# EAGLE design scout_mk1_b (EAGLE 7.1.0)
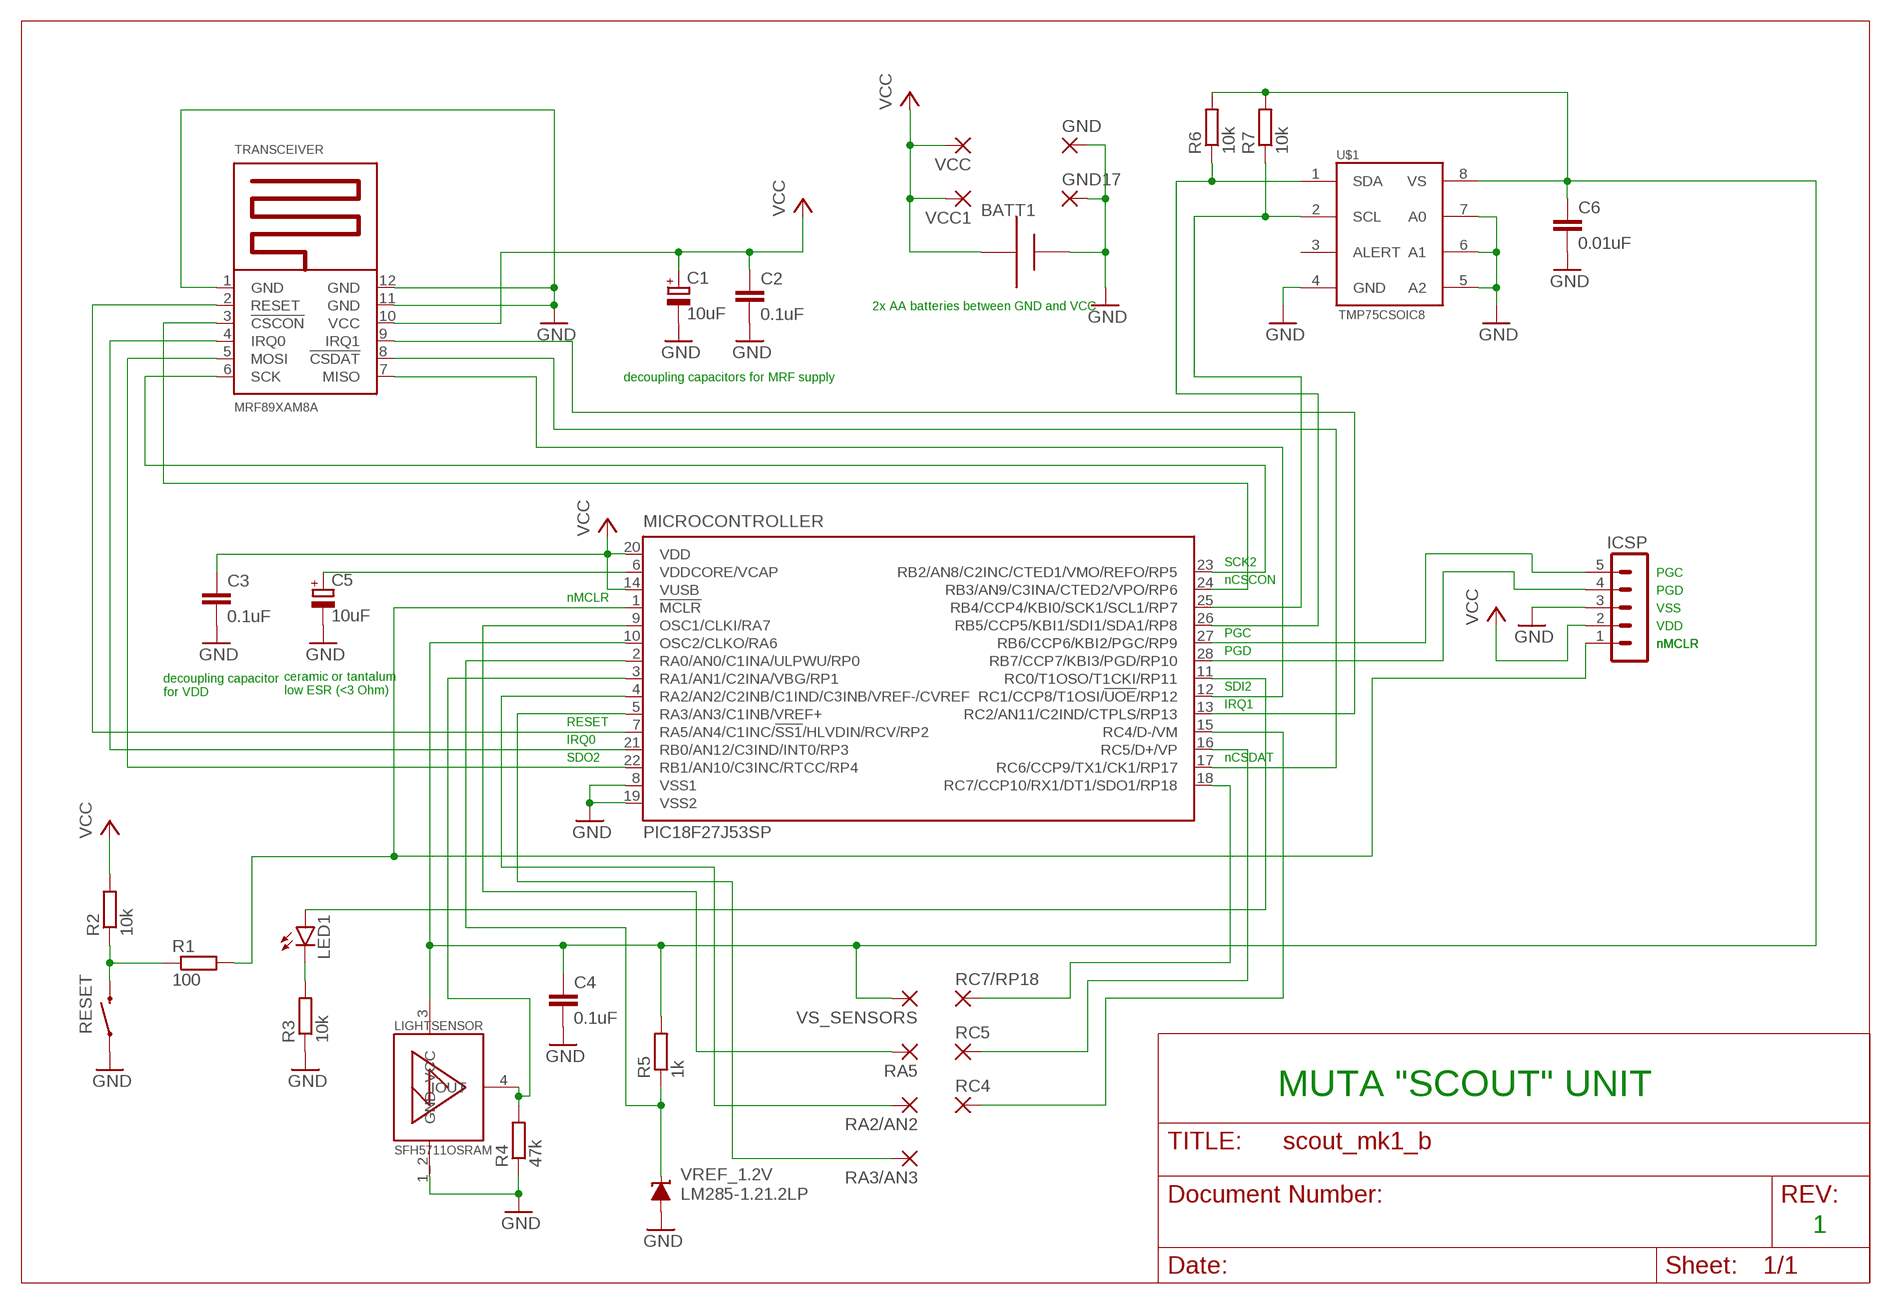
[diagram p0: schematic, sheet 1]

## Parts
BATT1  AAA  [2XAAA]
C1  10uF  CPOL-EUTT6D6  [TT5D6]
C2  0.1uF  C-EU050-025X075  [C050-025X075]
C3  0.1uF  C-EU050-025X075  [C050-025X075]
C4  0.1uF  C-EU050-025X075  [C050-025X075]
C5  10uF  CPOL-EUC/6032-28R  [C/6032-28R]
C6  0.01uF  C-EU050-025X075  [C050-025X075]
GND  3,81/1,1  [3,81/1,1]
GND17  3,81/1,1  [3,81/1,1]
ICSP  MA05-1  [MA05-1]
LED1  LED1206  [LED-1206]
LIGHTSENSOR  SFH5711OSRAM  [SFH5711]
MICROCONTROLLER  PIC18F27J53SP  [DIL28-3]
R1  100  R-EU_0207_10  [0207/10]
R2  10k  R-EU_0207_10  [0207/10]
R3  10k  R-EU_0207_2V  [0207/2V]
R4  47k  R-EU_0207_10  [0207/10]
R5  1k  R-EU_0207_10  [0207/10]
R6  10k  R-EU_0207_10  [0207/10]
R7  10k  R-EU_0207_10  [0207/10]
RA2/AN2  3,81/1,1  [3,81/1,1]
RA3/AN3  3,81/1,1  [3,81/1,1]
RA5  3,81/1,1  [3,81/1,1]
RC4  3,81/1,1  [3,81/1,1]
RC5  3,81/1,1  [3,81/1,1]
RC7/RP18  3,81/1,1  [3,81/1,1]
RESET  SWITCH-MOMENTARY-2PTH  [TACTILE-PTH]
TRANSCEIVER  MRF89XAM8A  [MRF89XAMXA]
U$1  TMP75CSOIC8  [SOIC8]
VCC  3,81/1,1  [3,81/1,1]
VCC1  3,81/1,1  [3,81/1,1]
VREF_1.2V  LM285-1.21.2LP  [LP_O-PBCY-W3]
VS_SENSORS  3,81/1,1  [3,81/1,1]

## Nets
GND: BATT1.P$1(+) C1.- C2.2 C3.2 C4.2 C5.- C6.2 GND17.1(P) GND.1(P) ICSP.3 LIGHTSENSOR.1_2(GND) MICROCONTROLLER.8(VSS1) MICROCONTROLLER.19(VSS2) R3.1 R4.1 RESET.1 TRANSCEIVER.1(GND) TRANSCEIVER.11(GND) TRANSCEIVER.12(GND) U$1.4(GND) U$1.5(A2) U$1.6(A1) U$1.7(A0) VREF_1.2V.3(A)
N$2: LIGHTSENSOR.4(IOUT) MICROCONTROLLER.3(RA1/AN1/C2INA/VBG/RP1) R4.2
N$3: ICSP.1 MICROCONTROLLER.1(!MCLR) R1.2
N$4: C5.+ MICROCONTROLLER.6(VDDCORE/VCAP)
N$5: R1.1 R2.1 RESET.3
N$6: ICSP.4 MICROCONTROLLER.28(RB7/CCP7/KBI3/PGD/RP10)
N$7: ICSP.5 MICROCONTROLLER.27(RB6/CCP6/KBI2/PGC/RP9)
N$8: MICROCONTROLLER.2(RA0/AN0/C1INA/ULPWU/RP0) R5.1 VREF_1.2V.2(C)
N$9: MICROCONTROLLER.7(RA5/AN4/C1INC/!SS1!/HLVDIN/RCV/RP2) TRANSCEIVER.2(RESET)
N$10: MICROCONTROLLER.23(RB2/AN8/C2INC/CTED1/VMO/REFO/RP5) TRANSCEIVER.6(SCK)
N$11: MICROCONTROLLER.26(RB5/CCP5/KBI1/SDI1/SDA1/RP8) R6.1 U$1.1(SDA)
N$12: MICROCONTROLLER.25(RB4/CCP4/KBI0/SCK1/SCL1/RP7) R7.1 U$1.2(SCL)
N$13: MICROCONTROLLER.9(OSC1/CLKI/RA7) RA5.1(P)
N$14: LED1.C R3.2
N$15: LED1.A MICROCONTROLLER.11(RC0/T1OSO/T1CKI/RP11)
N$16: MICROCONTROLLER.4(RA2/AN2/C2INB/C1IND/C3INB/VREF-/CVREF) RA2/AN2.1(P)
N$17: MICROCONTROLLER.5(RA3/AN3/C1INB/VREF+) RA3/AN3.1(P)
N$19: MICROCONTROLLER.12(RC1/CCP8/T1OSI/!UOE!/RP12) TRANSCEIVER.7(MISO)
N$21: MICROCONTROLLER.24(RB3/AN9/C3INA/CTED2/VPO/RP6) TRANSCEIVER.3(!CSCON)
N$22: MICROCONTROLLER.22(RB1/AN10/C3INC/RTCC/RP4) TRANSCEIVER.5(MOSI)
N$23: MICROCONTROLLER.21(RB0/AN12/C3IND/INT0/RP3) TRANSCEIVER.4(IRQ0)
N$24: MICROCONTROLLER.13(RC2/AN11/C2IND/CTPLS/RP13) TRANSCEIVER.9(IRQ1)
N$25: MICROCONTROLLER.17(RC6/CCP9/TX1/CK1/RP17) TRANSCEIVER.8(!CSDAT)
N$26: MICROCONTROLLER.18(RC7/CCP10/RX1/DT1/SDO1/RP18) RC7/RP18.1(P)
N$27: MICROCONTROLLER.16(RC5/D+/VP) RC5.1(P)
N$28: MICROCONTROLLER.15(RC4/D-/VM) RC4.1(P)
N$29: C4.1 C6.1 LIGHTSENSOR.3(VCC) MICROCONTROLLER.10(OSC2/CLKO/RA6) R5.2 R6.2 R7.2 U$1.8(VS) VS_SENSORS.1(P)
VCC: BATT1.P$2(-) C1.+ C2.1 C3.1 ICSP.2 MICROCONTROLLER.14(VUSB) MICROCONTROLLER.20(VDD) R2.2 TRANSCEIVER.10(VCC) VCC1.1(P) VCC.1(P)
Unconnected: U$1.3(ALERT)

## Notes on the sheet
- 2x AA batteries between GND and VCC
- decoupling capacitors for MRF supply
- SCK2
- PGC
- nCSCON
- PGD
- nMCLR
- VSS
- VDD
- PGC
- nMCLR | nMCLR
- PGD
- SDI2
- ceramic or tantalum
  low ESR (<3 Ohm)
- decoupling capacitor
  for VDD
- IRQ1
- RESET
- IRQ0
- SDO2 | nCSDAT
- MUTA "SCOUT" UNIT
- 1

## Library data of the parts
BATT1 = nio:AAA: AAA PC pin holder Mouser part #12BH412 - but pretty much any 1x AAA battery holder should be the same http://www.ladyada.net/library/pcb/eaglelibrary.html
C1 C5 = resistor:CPOL-EU: POLARIZED CAPACITOR, European symbol
C2-C4 C6 = rcl:C-EU: CAPACITOR, European symbol
GND GND17 RA2/AN2 RA3/AN3 RA5 RC4 RC5 RC7/RP18 VCC VCC1 VS_SENSORS = wirepad:3,81/1,1: THROUGH-HOLE PAD
ICSP = con-lstb:MA05-1: PIN HEADER; OC_FARNELL: unknown; OC_NEWARK: unknown
LED1 = SparkFun-LED:LED: LEDs Standard schematic elements and footprints for 5mm, 3mm, 1206, and 0603 sized LEDs. 5mm - Spark Fun Electronics SKU : COM-00529 (and others)
LIGHTSENSOR = nio:SFH5711
MICROCONTROLLER = microchip:PIC18F2*J53: PIC18F47J53 Family High-Performance USB Microcontrollers with nanoWatt XLP Technology Source: Data sheet <http://ww1.microchip.com/downloads/en/DeviceDoc/39964B.pdf>; MPN: PIC18F27J53-I/SP; OC_FARNELL: unknown; OC_NEWARK: 63R7839
R1-R7 = resistor:R-EU_: RESISTOR, European symbol; SPICEPREFIX: R
RESET = SparkFun-Electromechanical:SWITCH-MOMENTARY-2: Various NO switches- pushbuttons, reed, etc
TRANSCEIVER = microchip2:MRF89XAM8A: Microchip MRF89XAM8A 868MHz Module
U$1 = nio:TMP75C
VREF_1.2V = texas:LM285-1.2

## Board
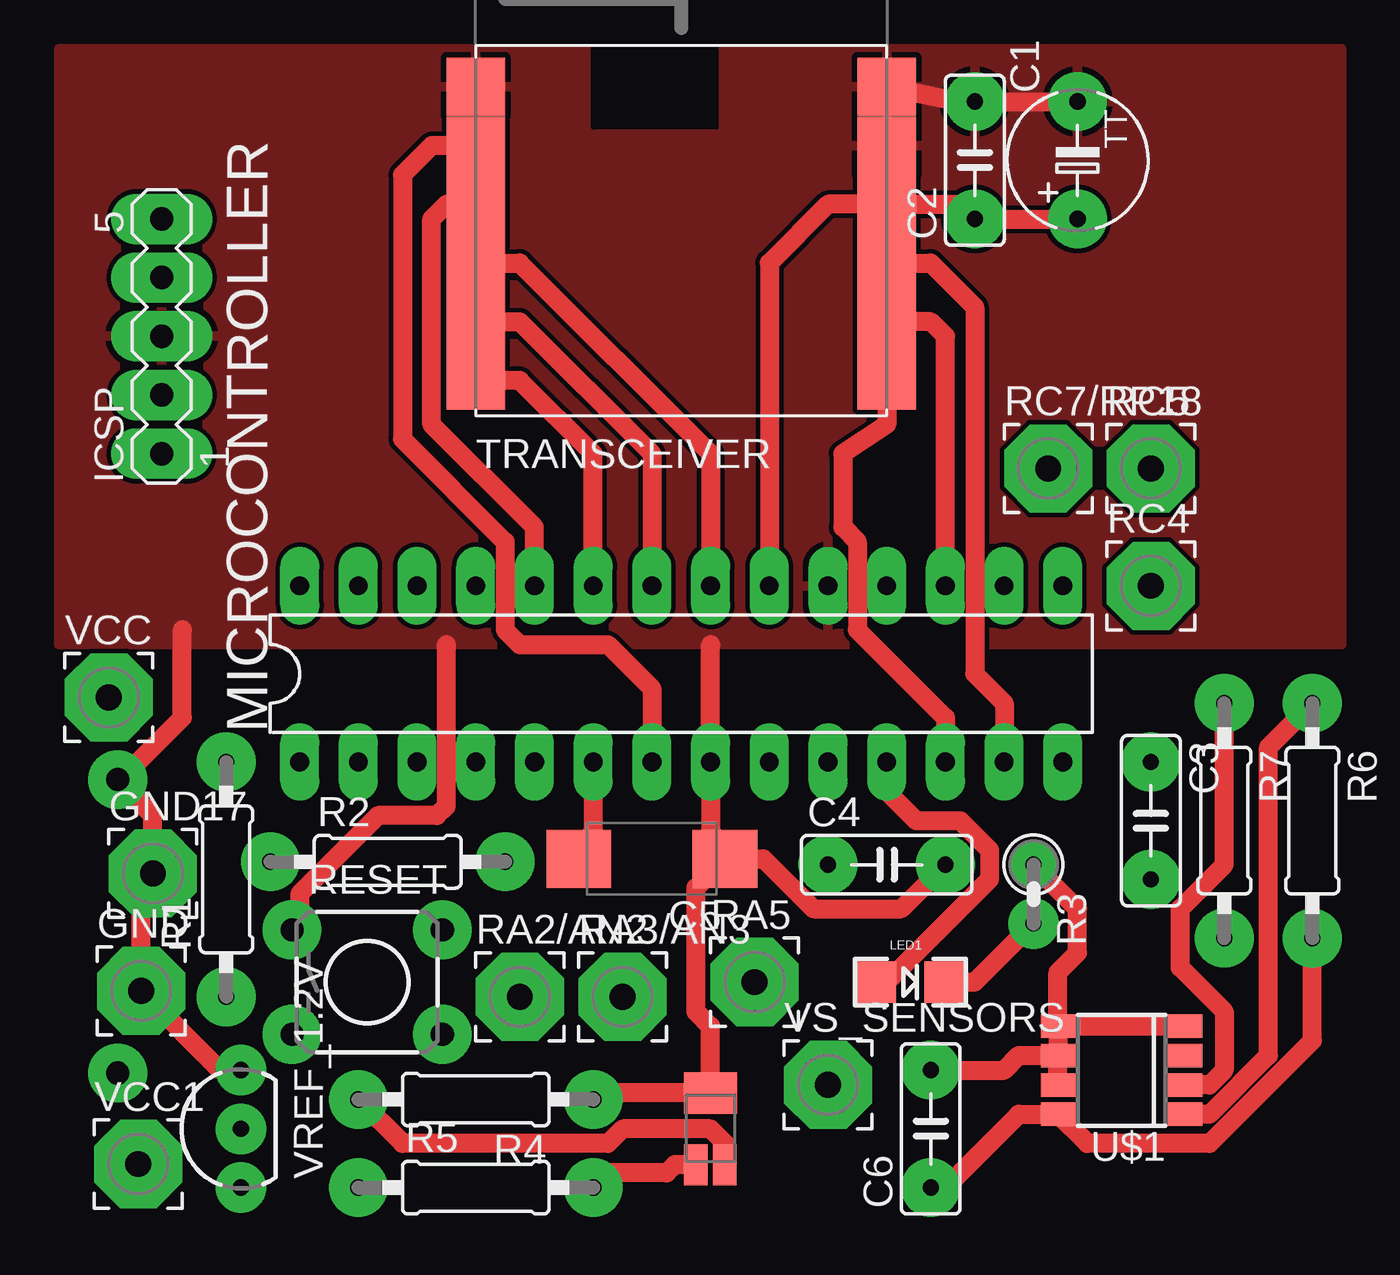
[diagram p1: board, top side]
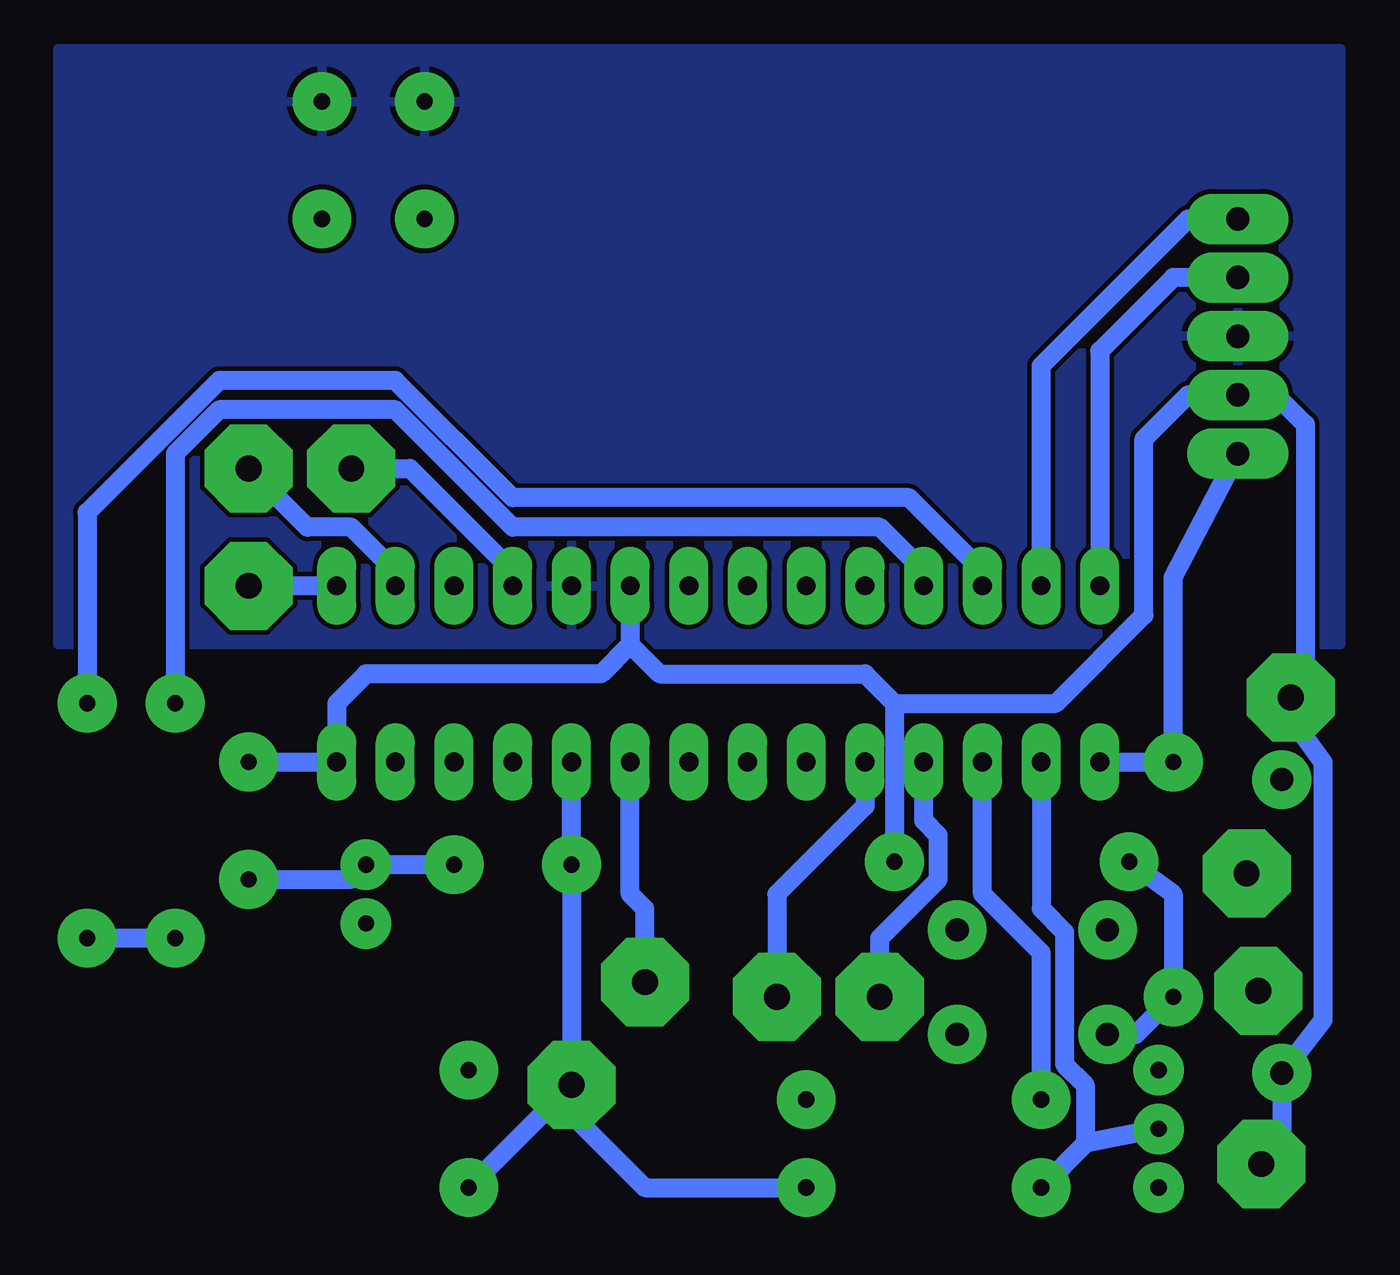
[diagram p2: board, bottom side, seen from below]

No outline drawn. Coordinates in mm, seen from the top.
Copper layers (1*16): Top 0.035mm / dielectric 1.5mm / Bottom 0.035mm
Design rules "default *": minimum track width 10mil, minimum drill 24mil, track to track 8mil, track to pad 8mil, pad to pad 8mil, via to via 8mil, smd to smd 8mil, copper to edge 40mil, drill to drill 8mil, minimum pad ring 10mil, minimum via ring 8mil, stop-mask expansion 4mil, vias tented up to drill 0mil, thermal gap 10mil
Holes 0.6 mm at 0,0 61.59,0

### Footprints (pad centres in the part's own frame; a part is rotated, then mirrored left to right if it is on the bottom)
2XAAA = drill 1 pad 2.54: P$1 0,12.7; P$2 0,0
TT5D6 = drill 0.7 pad 2.54: + -2.54,0; - 2.54,0
C050-025X075 = drill 0.7 pad 2.54: 1 -2.54,0; 2 2.54,0
C/6032-28R = smd 2.794 x 2.5: + 3.16,0; - -3.16,0
3,81/1,1 = drill 1.118 pad 3.81 octagon: 1 0,0
MA05-1 = drill 1.016 pad 2.184 long: 1 -5.08,0; 2 -2.54,0; 3 0,0; 4 2.54,0; 5 5.08,0
LED-1206 = smd 1.778 x 1.778: A -1.5,0; C 1.5,0
SFH5711 = smd 2.286 x 1.778: 1_2 0,1.549 | smd 1.016 x 1.778: 3 -0.635,-1.549; 4 0.61,-1.549
DIL28-3 = drill 0.813 pad 1.676 long: 1 -16.51,-3.81; 2 -13.97,-3.81; 3 -11.43,-3.81; 4 -8.89,-3.81; 5 -6.35,-3.81; 6 -3.81,-3.81; 7 -1.27,-3.81; 8 1.27,-3.81; 9 3.81,-3.81; 10 6.35,-3.81; 11 8.89,-3.81; 12 11.43,-3.81; 13 13.97,-3.81; 14 16.51,-3.81; 15 16.51,3.81; 16 13.97,3.81; 17 11.43,3.81; 18 8.89,3.81; 19 6.35,3.81; 20 3.81,3.81; 21 1.27,3.81; 22 -1.27,3.81; 23 -3.81,3.81; 24 -6.35,3.81; 25 -8.89,3.81; 26 -11.43,3.81; 27 -13.97,3.81; 28 -16.51,3.81
0207/10 = drill 0.7 pad 2.54: 1 -5.08,0; 2 5.08,0
0207/2V = drill 0.7 pad 2.184: 1 -1.27,0; 2 1.27,0
TACTILE-PTH = drill 1 pad 2.54: 1 -3.251,2.261; 2 3.251,2.261; 3 -3.251,-2.261; 4 3.251,-2.261
MRF89XAMXA = smd 2.515 x 2.515: 1 -8.89,-1.27; 2 -8.89,-3.81; 3 -8.89,-6.35; 4 -8.89,-8.89; 5 -8.89,-11.43; 6 -8.89,-13.97; 7 8.89,-13.97; 8 8.89,-11.43; 9 8.89,-8.89; 10 8.89,-6.35; 11 8.89,-3.81; 12 8.89,-1.27
SOIC8 = smd 1.016 x 1.5: 1 -1.905,-2.75; 2 -0.635,-2.75; 3 0.635,-2.75; 4 1.905,-2.75; 5 1.905,2.75; 6 0.635,2.75; 7 -0.635,2.75; 8 -1.905,2.75
LP_O-PBCY-W3 = drill 0.7 pad 2.184: 1 -2.54,0; 2 0,0; 3 2.54,0

### Placement (x,y rotation side)
BATT1  5.46,9.4 0 top
C1  46.99,48.9 90 top
C2  42.55,48.9 90 top
C3  50.16,20.32 270 top
C4  38.73,18.41 0 top
C5  28.57,18.67 180 top
C6  40.64,6.99 90 top
GND  6.48,12.95 0 top
GND17  6.99,18.03 0 top
ICSP  7.37,41.27 90 top
LED1  39.75,13.34 0 top
LIGHTSENSOR  31.11,6.99 0 top
MICROCONTROLLER  29.84,26.67 0 top
R1  10.16,17.78 90 top
R2  17.14,18.54 0 top
R3  45.09,17.14 270 top
R4  20.95,8.26 180 top
R5  20.95,4.45 0 top
R6  57.15,20.32 270 top
R7  53.34,20.32 270 top
RA2/AN2  22.86,12.7 0 top
RA3/AN3  27.3,12.7 0 top
RA5  33.02,13.34 0 top
RC4  50.16,30.48 0 top
RC5  50.16,35.56 0 top
RC7/RP18  45.72,35.56 0 top
RESET  16.26,13.34 0 top
TRANSCEIVER  29.84,53.34 0 top
U$1  48.9,9.53 90 top
VCC  5.08,25.65 0 top
VCC1  6.35,5.46 0 top
VREF_1.2V  10.79,6.99 90 top
VS_SENSORS  36.2,8.89 0 top

### Tracks (layer width: path | path; a pad name or v marks a point on that pad's centre or on a via)
GND
  Top 0.813: C5.- 31.11,19.92 MICROCONTROLLER.8 31.11,27.94 | 19.68,27.94 19.68,20.95 19.27,20.54 16.73,20.54 13.34,17.14 13.34,15.93 RESET.1 | TRANSCEIVER.12 41.91,51.44 C2.2 C1.- | C5.- 33.4,18.67 35.56,16.51 39.37,16.51 C4.2 | C5.- 30.48,17.41 30.48,12.06 31.11,11.43 LIGHTSENSOR.1_2 26.31,8.53 R4.1 | C6.2 43.81,9.53 44.45,10.16 U$1.6 | U$1.7 U$1.6 | U$1.5 U$1.6 | U$1.5 46.15,13.76 46.99,14.61 46.99,16.51 R3.1 | U$1.4 U$1.5 | 8.26,28.57 8.26,24.77 5.59,22.1 BATT1.P$1 6.99,20.57 GND17.1 6.48,17.53 GND.1 9.91,9.53 VREF_1.2V.3
  Bottom 0.813: C3.2 45.72,17.78 R3.1 C4.2
  pour Bottom (isolate 0.025): 2.92,53.72 2.92,27.94 58.42,27.94 58.42,53.72
  pour Top (isolate 0.025): 2.92,53.72 2.92,27.94 58.42,27.94 58.42,53.72
N$2
  Top 0.813: LIGHTSENSOR.4 31.73,6.38 31.11,6.99 27.3,6.99 26.67,6.35 17.78,6.35 R4.2
  Bottom 0.813: R4.2 15.88,14.61 18.41,17.14 MICROCONTROLLER.3
N$3
  Bottom 0.813: MICROCONTROLLER.1 R1.2 10.16,30.86 ICSP.1
N$4
  Top 0.813: MICROCONTROLLER.6 26.04,19.92 C5.+
N$5
  Bottom 0.813: RESET.3 11.79,11.07 R1.1 10.16,17.14 R2.1
N$6
  Bottom 0.813: ICSP.4 10.16,43.81 13.34,40.64 MICROCONTROLLER.28
N$7
  Bottom 0.813: MICROCONTROLLER.27 15.88,40.01 9.53,46.35 ICSP.5
N$8
  Bottom 0.813: VREF_1.2V.2 13.97,6.35 | 13.97,6.35 R5.1 | MICROCONTROLLER.2 15.88,16.51 14.86,15.49 14.86,9.78 13.97,8.89 13.97,6.35
N$9
  Top 0.813: TRANSCEIVER.2 19.05,49.53 17.78,48.26 17.78,36.83 22.23,32.38 22.23,28.57 22.86,27.94 26.67,27.94 28.57,26.04 MICROCONTROLLER.7
N$10
  Top 0.813: MICROCONTROLLER.23 26.04,36.2 22.86,39.37 TRANSCEIVER.6
N$11
  Top 0.813: R6.1 55.24,23.5 55.24,10.16 52.7,7.62 U$1.1
  Bottom 0.813: MICROCONTROLLER.26 18.41,31.11 21.59,34.29 38.73,34.29 43.81,39.37 51.44,39.37 57.15,33.66 R6.1
N$12
  Top 0.813: R7.1 53.34,18.41 51.44,16.51 51.44,13.97 53.34,12.06 53.34,9.53 52.7,8.89 U$1.2
  Bottom 0.813: MICROCONTROLLER.25 20.95,31.11 22.86,33.02 38.73,33.02 43.81,38.1 51.44,38.1 53.34,36.2 R7.1
N$13
  Bottom 0.813: RA5.1 33.02,16.51 33.66,17.14 MICROCONTROLLER.9
N$14
  Top 0.813: LED1.C 42.55,13.34 R3.2
N$15
  Top 0.813: MICROCONTROLLER.11 38.73,21.59 40.01,20.32 41.91,20.32 43.18,19.05 43.18,17.78 38.73,13.34 LED1.A
N$16
  Bottom 0.813: RA2/AN2.1 22.86,15.24 20.32,17.78 20.32,19.68 20.95,20.32 MICROCONTROLLER.4
N$17
  Bottom 0.813: MICROCONTROLLER.5 23.5,20.95 27.3,17.14 RA3/AN3.1
N$19
  Top 0.813: TRANSCEIVER.7 38.73,37.47 36.83,36.2 36.83,33.02 37.47,32.38 37.47,28.57 41.27,24.77 MICROCONTROLLER.12
N$21
  Top 0.813: MICROCONTROLLER.24 23.5,33.02 19.05,37.47 19.05,46.35 19.68,46.99 TRANSCEIVER.3
N$22
  Top 0.813: TRANSCEIVER.5 22.86,41.91 28.57,36.2 MICROCONTROLLER.22
N$23
  Top 0.813: TRANSCEIVER.4 22.86,44.45 31.11,36.2 MICROCONTROLLER.21
N$24
  Top 0.813: TRANSCEIVER.9 40.64,44.45 42.55,42.55 42.55,26.67 43.81,25.4 MICROCONTROLLER.13
N$25
  Top 0.813: MICROCONTROLLER.17 41.27,41.27 40.64,41.91 TRANSCEIVER.8
N$26
  Bottom 0.813: RC7/RP18.1 43.18,35.56 38.73,31.11 MICROCONTROLLER.18
N$27
  Bottom 0.813: MICROCONTROLLER.16 43.81,31.11 45.72,33.02 47.62,33.02 RC5.1
N$28
  Bottom 0.813: MICROCONTROLLER.15 RC4.1
N$29
  Top 0.813: R6.2 57.15,10.79 52.7,6.35 47.41,6.35 U$1.8 44.45,7.62 41.27,4.45 C6.1 | LIGHTSENSOR.3 29.57,5.44 29.21,5.08 26.67,5.08 R5.2
  Bottom 0.813: R6.2 R7.2 | MICROCONTROLLER.10 C4.1 VS_SENSORS.1 36.2,7.62 | 36.2,7.62 33.02,4.45 R5.2 | 36.2,7.62 37.47,7.62 C6.1
VCC
  Top 0.813: MICROCONTROLLER.20 33.66,44.45 36.2,46.99 TRANSCEIVER.10 41.91,46.99 C2.1 C1.+
  Bottom 0.813: 33.66,27.94 34.92,26.67 45.09,26.67 46.35,25.4 MICROCONTROLLER.14 C3.1 | MICROCONTROLLER.20 33.66,27.94 | 33.66,27.94 32.38,26.67 23.5,26.67 22.23,25.4 | 22.23,25.4 R2.2 | 22.23,25.4 15.24,25.4 11.43,29.21 11.43,36.83 9.53,38.73 ICSP.2 5.71,38.73 4.45,37.47 4.45,26.29 VCC.1 5.08,24.77 3.68,22.86 3.68,11.68 BATT1.P$2 5.46,6.35 VCC1.1